# Altium schematic sheet Power.SchDoc
size B; DocumentNumber: 6; SheetNumber: 6; SheetTotal: 7; ENG_APP_DATE: --/--/--; DSN_APP_DATE: --/--/--; CHK_APP_DATE: --/--/--
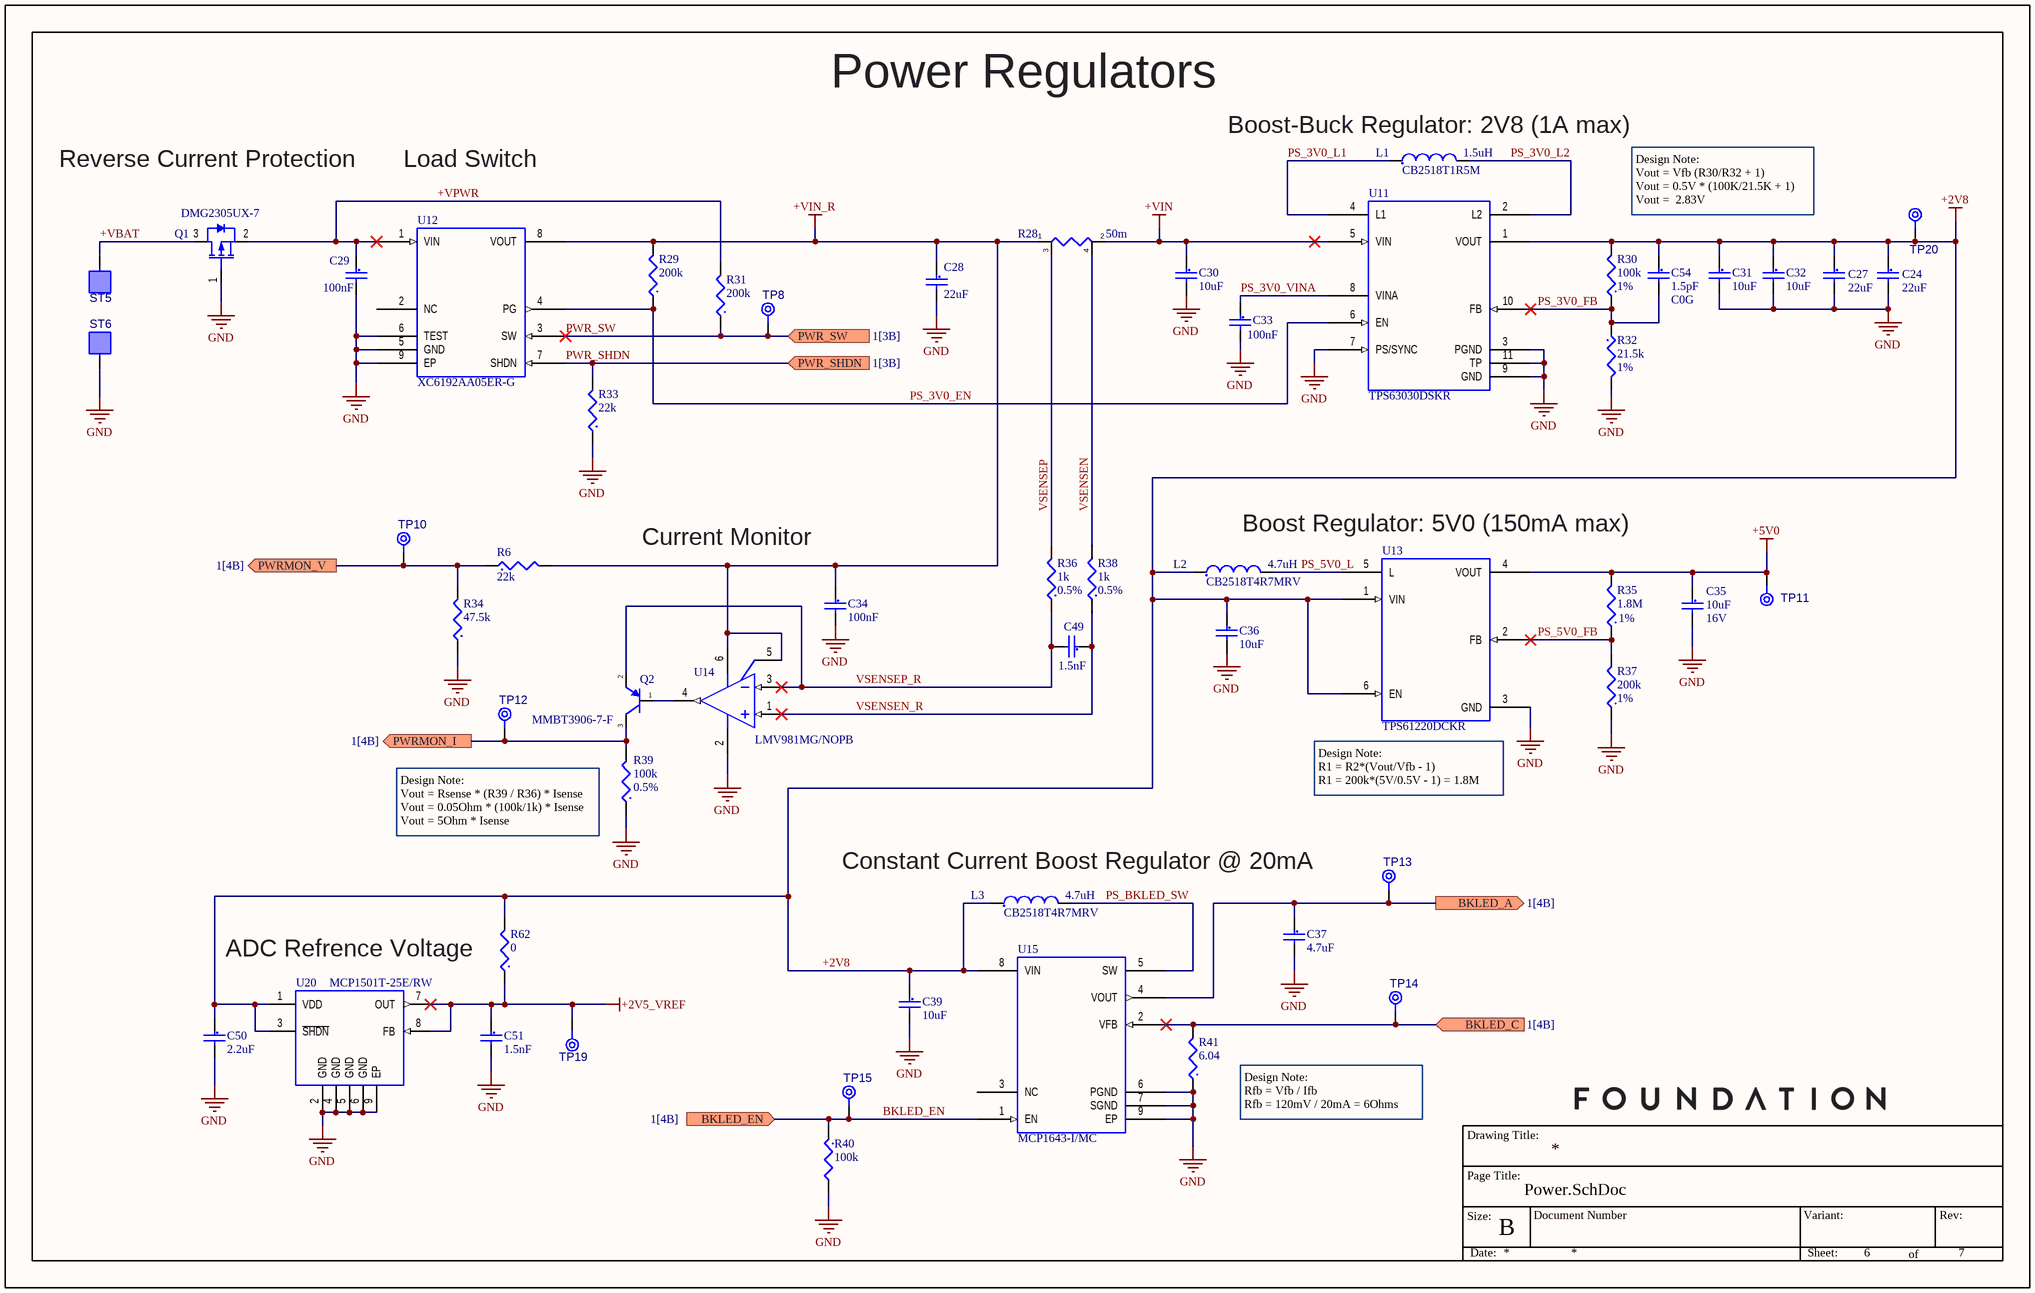
[diagram p0: Power.SchDoc]

## Parts
C24  Capacitance: 22uF  [CAPC0805(2012)145_L]  (hidden comment: CAP CER 22uF 16V 10% X5R 0805)
C27  Capacitance: 22uF  [CAPC0805(2012)145_L]  (hidden comment: CAP CER 22uF 16V 10% X5R 0805)
C28  Capacitance: 22uF  [CAPC0805(2012)145_L]  (hidden comment: CAP CER 22uF 16V 10% X5R 0805)
C29  Capacitance: 100nF  [CAPC0402(1005)55_L]  (hidden comment: CAP CER 0.1uF 16V 10% X7R 0402)
C30  Capacitance: 10uF  [CAPC0603(1608)90_L]  (hidden comment: CAP CER 10uF 6.3V 20% X5R 0603)
C31  Capacitance: 10uF  [CAPC0603(1608)90_L]  (hidden comment: CAP CER 10uF 6.3V 20% X5R 0603)
C32  Capacitance: 10uF  [CAPC0603(1608)90_L]  (hidden comment: CAP CER 10uF 6.3V 20% X5R 0603)
C33  Capacitance: 100nF  [CAPC0402(1005)55_L]  (hidden comment: CAP CER 0.1uF 16V 10% X7R 0402)
C34  Capacitance: 100nF  [CAPC0402(1005)55_L]  (hidden comment: CAP CER 0.1uF 16V 10% X7R 0402)
C35  Capacitance: 10uF  Voltage Rating (DC): 16V  [CAPC0603(1608)90_L]  (hidden comment: CAP CER 10uF 16V 20% X5R 0603)
C36  Capacitance: 10uF  [CAPC0603(1608)90_L]  (hidden comment: CAP CER 10uF 6.3V 20% X5R 0603)
C37  Capacitance: 4.7uF  [CAPC0603(1608)90_L]  (hidden comment: CAP CER 4.7uF 16V 10% X5R 0603)
C39  Capacitance: 10uF  [CAPC0603(1608)90_L]  (hidden comment: CAP CER 10uF 6.3V 20% X5R 0603)
C49  Capacitance: 1.5nF  [CAPC0402(1005)55_L]  (hidden comment: CAP CER 1500pF 50V 10% X7R 0402)
C50  Capacitance: 2.2uF  [CAPC0402(1005)55_L]  (hidden comment: CAP CER 2.2uF 6.3V 10% X5R 0402)
C51  Capacitance: 1.5nF  [CAPC0402(1005)55_L]  (hidden comment: CAP CER 1500pF 50V 10% X7R 0402)
C54  Capacitance: 1.5pF  Dielectric: C0G  [CAPC0402(1005)55_L]  (hidden comment: CAP CER 1.5pF 50V C0G 0402)
L1  CB2518T1R5M  Inductance: 1.5uH  [INDC1007(2518)_L]
L2  CB2518T4R7MRV  Inductance: 4.7uH  [INDC1007(2518)_L]
L3  CB2518T4R7MRV  Inductance: 4.7uH  [INDC1007(2518)_L]
Q1  DMG2305UX-7  [DIOD-SOT23-3_A_V]
Q2  MMBT3906-7-F  [DIOD-SOT23-3_A_V]
R6  Resistance: 22k  [RESC0402(1005)_L]  (hidden comment: RES 22K 1/16W 1% 0402)
R28  Resistance: 50m  [RESC4T1206(3216)_V]  (hidden comment: RES4T 0.05 OHM 0.5% 1/2W 1206)
R29  Resistance: 200k  [RESC0402(1005)_L]  (hidden comment: RES 200K 1/16W 1% 0402)
R30  Resistance: 100k  Tolerance: 1%  [RESC0402(1005)_L]  (hidden comment: RES 100K 1/16W 1% 0402)
R31  Resistance: 200k  [RESC0402(1005)_L]  (hidden comment: RES 200K 1/16W 1% 0402)
R32  Resistance: 21.5k  Tolerance: 1%  [RESC0402(1005)_L]  (hidden comment: RES 21.5K 1/16W 1% 0402)
R33  Resistance: 22k  [RESC0402(1005)_L]  (hidden comment: RES 22K 1/16W 1% 0402)
R34  Resistance: 47.5k  [RESC0402(1005)_L]  (hidden comment: RES 47.5K 1/16W 1% 0402)
R35  Resistance: 1.8M  Tolerance: 1%  [RESC0402(1005)_L]  (hidden comment: RES 1.8M 1/16W 1% 0402)
R36  Resistance: 1k  Tolerance: 0.5%  [RESC0402(1005)_L]  (hidden comment: RES 1.0K 1/16W 1% 0402)
R37  Resistance: 200k  Tolerance: 1%  [RESC0402(1005)_L]  (hidden comment: RES 200K 1/16W 1% 0402)
R38  Resistance: 1k  Tolerance: 0.5%  [RESC0402(1005)_L]  (hidden comment: RES 1.0K 1/16W 1% 0402)
R39  Resistance: 100k  Tolerance: 0.5%  [RESC0402(1005)_L]  (hidden comment: RES 100K 1/16W 0.5% 0402)
R40  Resistance: 100k  [RESC0402(1005)_L]  (hidden comment: RES 100K 1/16W 1% 0402)
R41  Resistance: 6.04  [RESC0402(1005)_L]  (hidden comment: RES 6.04 OHM 1/16W 1% 0402)
R62  Resistance: 0  [RESC0402(1005)_L]  (hidden comment: RES 0 OHM JUMPER 1/16W 0402)
ST5  PAD-2_54X2_54Y  [PAD-2_54X2_54Y]  (value not drawn)  (no BOM)
ST6  PAD-2_54X2_54Y  [PAD-2_54X2_54Y]  (value not drawn)  (no BOM)
TP8  TPAD8R  [TP08R]  (value not drawn)  (no BOM)
TP10  TPAD8R  [TP08R]  (value not drawn)  (no BOM)
TP11  TPAD8R  [TP08R]  (value not drawn)  (no BOM)
TP12  TPAD8R  [TP08R]  (value not drawn)  (no BOM)
TP13  TPAD8R  [TP08R]  (value not drawn)  (no BOM)
TP14  TPAD8R  [TP08R]  (value not drawn)  (no BOM)
TP15  TPAD8R  [TP08R]  (value not drawn)  (no BOM)
TP19  TPAD8R  [TP08R]  (value not drawn)  (no BOM)
TP20  TPAD8R  [TP08R]  (value not drawn)  (no BOM)
U11  TPS63030DSKR  [TI - VSON-10_L]
U12  XC6192AA05ER-G  [TORX - USP-8B06_V]
U13  TPS61220DCKR  [TI - SC70-6_L]
U14  LMV981MG/NOPB  [TI - SC70-6_L]
U15  MCP1643-I/MC  [MCHP - DFN-8_L]
U20  MCP1501T-25E/RW  [MCHP - WDFN-8_L]

## Ports
BKLED_A (out, see 1[4B]), BKLED_C (in, see 1[4B]), BKLED_EN (in, see 1[4B]), PWR_SHDN (in, see 1[3B]), PWR_SW (in, see 1[3B]), PWRMON_I (out, see 1[4B]), PWRMON_V (out, see 1[4B])

## Nets
+2V5_VREF: C51.1 R62.1 TP19.1(TP) U20.7(OUT) U20.8(FB)
+2V8: C24.1 C27.1 C31.1 C32.1 C36.1 C39.1 C50.1 C54.1 L2.1 L3.1 R30.2 R62.2 TP20.1(TP) U11.1(VOUT) U13.1(VIN) U13.6(EN) U15.8(VIN) U20.1(VDD) U20.3(~{SHDN})
+5V0: C35.1 R35.2 TP11.1(TP) U13.4(VOUT)
+VIN: C30.1 R28.2(I2) U11.5(VIN)
+VIN_R: C28.1 C34.1 R6.2 R28.1(I1) R29.2 U12.8(VOUT) U14.5(~{SHDN}) U14.6(VDD)
GND: C24.2 C27.2 C28.2 C29.2 C30.2 C31.2 C32.2 C33.2 C34.2 C35.2 C36.2 C37.2 C39.2 C50.2 C51.2 Q1.1(GATE) R32.2 R33.1 R34.1 R37.1 R39.1 R40.2 R41.1 ST6.1 U11.3(PGND) U11.7(PS/SYNC) U11.9(GND) U11.11(TP) U12.5(GND) U12.6(TEST) U12.9(EP) U13.3(GND) U14.2(GND) U15.6(PGND) U15.7(SGND) U15.9(EP) U20.2(GND) U20.4(GND) U20.5(GND) U20.6(GND) U20.9(EP)
+VBAT: Q1.3(DRAIN) ST5.1
+VPWR: C29.1 Q1.2(SOURCE) R31.2 U12.1(VIN)
BKLED_A: C37.1 TP13.1(TP) U15.4(VOUT) ; port BKLED_A
BKLED_C: R41.2 TP14.1(TP) U15.2(VFB) ; port BKLED_C
BKLED_EN: R40.1 TP15.1(TP) U15.1(EN) ; port BKLED_EN
PS_3V0_EN: R29.1 U11.6(EN) U12.4(PG)
PS_3V0_FB: C54.2 R30.1 R32.1 U11.10(FB)
PS_3V0_L1: L1.1 U11.4(L1)
PS_3V0_L2: L1.2 U11.2(L2)
PS_3V0_VINA: C33.1 U11.8(VINA)
PS_5V0_FB: R35.1 R37.2 U13.2(FB)
PS_5V0_L: L2.2 U13.5(L)
PS_BKLED_SW: L3.2 U15.5(SW)
PWR_SHDN: R33.2 U12.7(SHDN) ; port PWR_SHDN
PWR_SW: R31.1 TP8.1(TP) U12.3(SW) ; port PWR_SW
PWRMON_I: Q2.3(C) R39.2 TP12.1(TP) ; port PWRMON_I
PWRMON_V: R6.1 R34.2 TP10.1(TP) ; port PWRMON_V
VSENSEN: R28.4(E2) R38.2
VSENSEN_R: C49.1 R38.1 U14.1(IN+)
VSENSEP: R28.3(E1) R36.2
VSENSEP_R: C49.2 Q2.2(E) R36.1 U14.3(IN-)
NetQ2_1: Q2.1(B) U14.4(OUT)

Not connected (* = marked no-connect by the designer): U12 2(NC); U15 3(NC)

## Notes on the sheet
- Power Regulators
- (near L1) Boost-Buck Regulator: 2V8 (1A max)
- Reverse Current Protection
- Load Switch
- Design Note:
  Vout = Vfb (R30/R32 + 1)
  Vout = 0.5V * (100K/21.5K + 1)
  Vout =  2.83V
- (near C34) Current Monitor
- Boost Regulator: 5V0 (150mA max)
- Design Note:
  Vout = Rsense * (R39 / R36) * Isense
  Vout = 0.05Ohm * (100k/1k) * Isense
  Vout = 5Ohm * Isense
- (near U13) Design Note:
  R1 = R2*(Vout/Vfb - 1)
  R1 = 200k*(5V/0.5V - 1) = 1.8M
- (near L3) Constant Current Boost Regulator @ 20mA
- ADC Refrence Voltage
- Design Note:
  Rfb = Vfb / Ifb
  Rfb = 120mV / 20mA = 6Ohms
- Drawing Title:
- Page Title:
- Size:
- B
- Document Number
- Variant:
- Rev:
- Date:
- Sheet:
- of

## Library data of the parts
C24 C27 C28 = CMP-CAP-00010-2: 22µF ±10% 16V Ceramic Capacitor X5R 0805 (2012 Metric); Packaging: Tape and Reel; Length: 2mm; Max Operating Temperature: 85°C; REACH SVHC: No SVHC; Lead Free: Lead Free; Termination: SMD/SMT; Width: 0.049inch; Thickness: 0.057inch; Min Operating Temperature: -55°C; Height: 1.25mm; Tolerance: 10%; Case/Package: 0805; Dielectric: X5R; Voltage: 16V; Mount: Surface Mount; Case Code (Imperial): 0805; Dielectric Material: Ceramic; Voltage Rating: 16V; Voltage Rating (DC): 16V; Depth: 1.25mm; Case Code (Metric): 2012; Package Quantity: 1; Weight: 0.000194oz; Number of Pins: 2; Composition: Ceramic
C29 C33 C34 = CMP-CAP-00002-2: 0.1µF ±10% 16V Ceramic Capacitor X7R 0402 (1005 Metric); Insulation Resistance: 10GR; Material: Ceramic; Tolerance: 10%; REACH SVHC: No SVHC; Radiation Hardening: No; Case Code (Metric): 1005; Height: 0.5mm; Depth: 0.5mm; Min Operating Temperature: -55°C; Max Operating Temperature: 125°C; Lead Free: Lead Free; Thickness: 0.022inch; Length: 1mm; Voltage Rating (DC): 16V; Dielectric Material: Ceramic; Packaging: Tape and Reel; Case/Package: 0402; Width: 0.5mm; Termination: SMD/SMT; Voltage Rating: 16V; Mount: Surface Mount; Case Code (Imperial): 0402; Package Quantity: 1; Dielectric: X7R; Number of Pins: 2; Voltage: 16V
C30-C32 C36 C39 = CMP-CAP-00044-1: 10µF ±20% 6.3V Ceramic Capacitor X5R 0603 (1608 Metric); Max Operating Temperature: 85°C; Packaging: Tape and Reel; Case Code (Metric): 1608; Radiation Hardening: No; REACH SVHC: No SVHC; Min Operating Temperature: -55°C; Tolerance: 20%; Lead Free: Lead Free; Thickness: 0.035inch; Voltage Rating (DC): 6.3V; Material: Ceramic; Width: 0.031inch; Length: 1.6mm; Voltage: 6.3V; Mount: Surface Mount; Voltage Rating: 6.3V; Termination: SMD/SMT; Depth: 0.8mm; Dielectric: X5R; Case/Package: 0603; Package Quantity: 4000; Case Code (Imperial): 0603; Height: 0.8mm
C35 = CMP-CAP-00036-1: 10µF ±20% 16V Ceramic Capacitor X5R 0603 (1608 Metric); Termination: SMD/SMT; Mount: Surface Mount; Halogen Free: Halogen Free; Packaging: Tape and Reel; Width: 0.031inch; Length: 0.063inch; Voltage Rating: 16V; Thickness: 0.031inch; Package Quantity: 1; REACH SVHC: Unknown; Max Operating Temperature: 85°C; Min Operating Temperature: -55°C; Case Code (Imperial): 0603; Dielectric: X5R; Height: 0.8mm; Case/Package: 0603; Tolerance: 20%; Case Code (Metric): 1608
C37 = CMP-CAP-00003-1: 4.7µF ±10% 16V Ceramic Capacitor X5R 0603 (1608 Metric); Max Operating Temperature: 85°C; Packaging: Tape and Reel; Case Code (Metric): 1608; REACH SVHC: No SVHC; Min Operating Temperature: -55°C; Tolerance: 10%; Thickness: 0.035inch; Voltage Rating (DC): 16V; Width: 0.8mm; Length: 1.6mm; Mount: Surface Mount; Voltage Rating: 16V; Termination: SMD/SMT; Dielectric: X5R; Case/Package: 0603; Package Quantity: 1; Case Code (Imperial): 0603; Height: 0.8mm; Composition: Ceramic; Number of Pins: 2
C49 C51 = CMP-CAP-00034-1: 1500pF ±10% 50V Ceramic Capacitor X7R 0402 (1005 Metric); Material: Ceramic; Tolerance: 10%; Radiation Hardening: No; Case Code (Metric): 1005; Height: 0.5mm; Depth: 0.5mm; Min Operating Temperature: -55°C; Max Operating Temperature: 125°C; Thickness: 0.022inch; Length: 1mm; Packaging: Tape and Reel; Case/Package: 0402; Width: 0.02inch; Voltage Rating: 50V; Mount: Surface Mount; Case Code (Imperial): 0402; Package Quantity: 1; Dielectric: X7R; Voltage: 50V; Contact Plating: Tin
C50 = CMP-CAP-00042-1: 2.2µF ±10% 6.3V Ceramic Capacitor X5R 0402 (1005 Metric); Lead Free: Lead Free; Tolerance: 10%; Width: 0.02inch; Number of Pins: 2; Contact Plating: Tin,Matte; Max Operating Temperature: 85°C; Termination: SMD/SMT; Voltage Rating: 6.3V; Thickness: 0.022inch; Case Code (Imperial): 0402; Case Code (Metric): 1005; Radiation Hardening: No; Package Quantity: 1; Mount: Surface Mount; Length: 1mm; Case/Package: 0402; REACH SVHC: No SVHC; Packaging: Tape and Reel; Min Operating Temperature: -55°C; Dielectric: X5R; Depth: 0.5mm; Voltage Rating (DC): 6.3V
C54 = CMP-CAP-00048-1: 1.5pF ±0.25pF 50V Ceramic Capacitor C0G, NP0 0402 (1005 Metric); Tolerance: 20%; Mount: Surface Mount; Min Operating Temperature: -55°C; Lead Free: Lead Free; Termination: SMD/SMT; Width: 0.02inch; Voltage: 50V; Height: 0.5mm; Package Quantity: 1; Voltage Rating (DC): 50V; Packaging: Tape and Reel; Max Operating Temperature: 125°C; Case Code (Imperial): 0402; Voltage Rating: 50V; Case/Package: 0402; Case Code (Metric): 1005; Thickness: 0.022inch; Length: 1mm; Radiation Hardening: No; Depth: 0.5mm
L1 = CMP-IND-0004-1: 1.5µH Unshielded Wirewound Inductor 1.4A 91mOhm Max 1007 (2518 Metric); Test Frequency: 7.96MHz; Saturation Current: 650mA; Tolerance: 20%; Self Resonant Frequency: 80MHz; DC Resistance (DCR): 91mR; Core Material: Ferrite; Termination: SMD/SMT; Shielding: Unshielded; Min Operating Temperature: -40°C; Current Rating: 1.4A; Max Operating Temperature: 105°C; Width: 1.8mm; Case/Package: 1007; Mount: Surface Mount; Height: 1.8mm; Height - Seated (Max): 0.079inch; Packaging: Tape and Reel; Length: 0.098inch; Composition: Wirewound; Package Quantity: 2000; Max DC Current: 650mA; ComponentLink1Description: Datasheet; ComponentLink1URL: https://www.yuden.co.jp/productdata/catalog/wound02_e.pdf; Radiation Hardening: No; Depth: 2mm; Lead Free: Lead Free; Case Code (Imperial): 1007; Halogen Free: Halogen Free; Case Code (Metric): 2518
L2 L3 = CMP-IND-0006-1: 4.7µH Unshielded Wirewound Inductor 820mA 130mOhm Max 1007 (2518 Metric); Max DC Current: 310mA; Tolerance: 20%; Test Frequency: 7.96MHz; DC Resistance (DCR): 130mR; Self Resonant Frequency: 46MHz; Resistance: 0.1R; Shielding: Unshielded; Height: 1.8mm; Packaging: Tape and Reel; Depth: 1.8mm; Mount: Surface Mount; Composition: Wirewound; Min Operating Temperature: -40°C; Current Rating: 820mA; Width: 0.071inch; Length: 0.098inch; Case/Package: 1007; Height - Seated (Max): 0.079inch; Termination: SMD/SMT; Package Quantity: 2000; Saturation Current: 310mA; Lead Free: Lead Free; Max Operating Temperature: 105°C; Case Code (Metric): 2518; Radiation Hardening: No; Case Code (Imperial): 1007
Q1 = CMP-TRNST-0000-3: P-Channel 20V 4.2A (Ta) 1.4W (Ta) Surface Mount SOT-23; Turn-Off Delay Time: 79.3ns; Fall Time: 34.7ns; On-State Resistance: 52MR; Vgs(th) (Max) @ Id: 900mV @ 250µA; Gate to Source Voltage (Vgs): 8V; Number of Channels: 1; Input Capacitance: 808pF; Element Configuration: Single; Threshold Voltage: -900mV; Drain to Source Resistance: 200mR; Rise Time: 13.7ns; Turn-On Delay Time: 10.8ns; ComponentLink1Description: Datasheet; Mount: Surface Mount; Max Operating Temperature: 150°C; Packaging: Tape and Reel; Continuous Drain Current (ID): 4.2A; REACH SVHC: No SVHC; Drain to Source Voltage (Vdss): 20V; RoHS Compliant: Yes; Height: 1.1mm; ComponentLink1URL: https://www.diodes.com/assets/Datasheets/DMG2305UX.pdf; Contact Plating: Tin,Matte; Weight: 0.000282oz; Package Quantity: 3000; Lead Free: Lead Free; Vgs (Max): 8V; Transistor Type: P-Channel; Rds On Max: 52mR; Width: 1.4mm; Number of Pins: 3; Max Power Dissipation: 1.4W; Case/Package: SOT-23; Min Operating Temperature: -55°C; Length: 3mm; Radiation Hardening: No
Q2 = CMP-TRNST-0001-1: TRANS PNP 40V 0.2A SOT23-3; Max Frequency: 250MHz; Continuous Collector Current: -200mA; Voltage Rating (DC): -40V; Element Configuration: Single; Number of Elements: 1; hFE Min: 100; Collector Emitter Saturation Voltage: -400mV; Power Dissipation: 300mW; Emitter Base Voltage (VEBO): 6V; Max Collector Current: 200mA; Max Operating Temperature: 150°C; Mount: Surface Mount; Packaging: Tape and Reel; Current Rating: -200mA; Gain Bandwidth Product: 250MHz; Case/Package: SOT-23; Collector Emitter Voltage (VCEO): 40V; Contact Plating: Tin,Matte; Transition Frequency: 250MHz; Collector Emitter Breakdown Voltage: 40V; ComponentLink1Description: Datasheet; Lead Free: Lead Free; Radiation Hardening: No; Collector Base Voltage (VCBO): 40V; Number of Pins: 3; ComponentLink1URL: https://media.digikey.com/pdf/Data%20Sheets/Diodes%20PDFs/MMBT3906.pdf; Frequency: 250MHz; Max Power Dissipation: 300mW; Package Quantity: 3000; Height: 1mm; Width: 1.4mm; Min Operating Temperature: -55°C; REACH SVHC: No SVHC; Length: 3.05mm; Polarity: PNP; Max Breakdown Voltage: 40V; Weight: 0.000282oz
R6 = CMP-RES-00040-1: 22 kOhms ±1% 0.063W, 1/16W Chip Resistor 0402 (1005 Metric); Temperature Coefficient: 100ppm/°C; Voltage Rating (DC): 50V; Power Rating: 63mW; Case/Package: 0402; Package Quantity: 10; Lead Free: Lead Free; Composition: Thick Film; Height: 0.35mm; Length: 1mm; Radiation Hardening: No; Width: 0.5mm; Max Operating Temperature: 155°C; Depth: 0.5mm; REACH SVHC: Unknown; Min Operating Temperature: -55°C; Case Code (Metric): 1005; Working Voltage: 50V; Mount: Surface Mount; Contact Plating: Tin; Number of Terminations: 2; Weight: 2.3E-05oz; Packaging: Tape and Reel; Termination: SMD/SMT; Tolerance: 1%; Case Code (Imperial): 0402; Military Standard: Not; Voltage Rating: 50V; Max Power Dissipation: 63mW; Features: Automotive AEC-Q200
R28 = CMP-RES-00044-2: 50 mOhms ±0.5% 0.5W, 1/2W Chip Resistor 1206 (3216 Metric) Current Sense; Temperature Coefficient: 35ppm/°C; Tolerance: 1%; Voltage Rating: 160mV; Max Power Dissipation: 500mW; Features: Moisture Resistant; Number of Terminations: 4; Length: 0.126inch; Case Code (Imperial): 1206; Lead Free: Lead Free; Composition: Metal Element; Max Operating Temperature: 170°C; Height: 0.035inch; Case/Package: 1206; Min Operating Temperature: -65°C; Case Code (Metric): 3216; Width: 0.063inch; Packaging: Tape and Reel
R29 R31 R37 = CMP-RES-00007-3: 200 kOhms ±1% 0.063W, 1/16W Chip Resistor 0402 (1005 Metric) Moisture Resistant Thick Film; Working Voltage: 50V; Temperature Coefficient: 100ppm/°C; Max Power Dissipation: 63mW; Power Rating: 62.5mW; Min Operating Temperature: -55°C; Depth: 0.5mm; Height: 0.016inch; Length: 1mm; Number of Terminations: 2; Termination: SMD/SMT; Composition: Thick Film; Military Standard: Not; Case Code (Metric): 1005; Case Code (Imperial): 0402; REACH SVHC: No SVHC; Voltage Rating (DC): 50V; Features: Moisture Resistant; Packaging: Tape and Reel; Width: 0.02inch; Lead Free: Lead Free; Package Quantity: 1; Voltage Rating: 50V; Case/Package: 0402; Max Operating Temperature: 155°C
  R29 R31: Tolerance: 1%
R30 = CMP-RES-00003-3: 100 kOhms ±1% 0.063W, 1/16W Chip Resistor 0402 (1005 Metric) Automotive AEC-Q200 Thick Film; Temperature Coefficient: 100ppm/°C; Max Power Dissipation: 63mW; Voltage Rating: 50V; Width: 0.02inch; Number of Terminations: 2; Composition: Thick Film; Radiation Hardening: No; Case Code (Imperial): 0402; Depth: 0.5mm; Packaging: Tape and Reel; Length: 1mm; Min Operating Temperature: -55°C; Contact Plating: Tin; Features: Automotive AEC-Q200; Max Operating Temperature: 155°C; Power Rating: 63mW; Mount: Surface Mount; Case Code (Metric): 1005; Case/Package: 0402; Height: 0.35mm; Lead Free: Lead Free; Military Standard: Not; Termination: SMD/SMT; Package Quantity: 10000; Voltage Rating (DC): 50V; REACH SVHC: Unknown; Number of Pins: 2; Weight: 2.3E-05oz
R32 = CMP-RES-00073-1: 21.5 kOhms ±1% 0.063W, 1/16W Chip Resistor 0402 (1005 Metric); Reference Standard: AEC-Q200; Package Height: 0.35mm; Rated Power Dissipation (P): 63mW; Rated Temperature: 70°C; Package Width: 0.5mm; Voltage Rating: 50V; Temperature Coefficient: 100ppm/°C; Number of Terminals/Pins: 2; Package Length: 1mm; Mount: Surface Mount; Resistor Type: FIXED RESISTOR; Max Operating Temperature: 155°C; JESD-609 Code: e3; Package Shape: Rectangular; Terminal Finish: Nickel; Packaging: Tape and Reel; Size Code: 0402; Package Style: SMTMeter; Technology: METAL GLAZE/THICK FILM; Termination: Wraparound; Working Voltage: 50V; Construction: Chip; Min Operating Temperature: -55°C
R33 = CMP-RES-00040-1: 22 kOhms ±1% 0.063W, 1/16W Chip Resistor 0402 (1005 Metric); Max Power Dissipation: 63mW; Voltage Rating: 50V; Temperature Coefficient: 100ppm/°C; Military Standard: Not; Lead Free: Lead Free; Max Operating Temperature: 155°C; Termination: SMD/SMT; REACH SVHC: Unknown; Packaging: Tape and Reel; Composition: Thick Film; Weight: 2.3E-05oz; Mount: Surface Mount; Height: 0.35mm; Length: 1mm; Min Operating Temperature: -55°C; Radiation Hardening: No; Voltage Rating (DC): 50V; Number of Terminations: 2; Features: Automotive AEC-Q200; Package Quantity: 10; Depth: 0.5mm; Working Voltage: 50V; Case/Package: 0402; Case Code (Metric): 1005; Case Code (Imperial): 0402; Tolerance: 1%; Power Rating: 63mW; Width: 0.5mm; Contact Plating: Tin
R34 = CMP-RES-00048-1: 47.5 kOhms ±1% 0.063W, 1/16W Chip Resistor 0402 (1005 Metric); Temperature Coefficient: 100ppm/°C; Power Rating: 63mW; Voltage Rating (DC): 50V; Number of Pins: 2; REACH SVHC: Unknown; Weight: 2.3E-05oz; Height: 0.35mm; Number of Terminations: 2; Case Code (Imperial): 0402; Case/Package: 0402; Features: Automotive AEC-Q200; Max Operating Temperature: 155°C; Case Code (Metric): 1005; Packaging: Tape and Reel; Length: 1mm; Min Operating Temperature: -55°C; Voltage Rating: 50V; Max Power Dissipation: 63mW; Package Quantity: 10; Mount: Surface Mount; Contact Plating: Tin; Tolerance: 1%; Width: 0.02inch; Lead Free: Lead Free; Composition: Thick Film; Radiation Hardening: No; Military Standard: Not; Termination: SMD/SMT; Depth: 0.5mm
R35 = CMP-RES-00016-4: 1.8 MOhms ±1% 0.063W, 1/16W Chip Resistor 0402 (1005 Metric); Voltage Rating: 50V; Power Rating: 63mW; Temperature Coefficient: 100ppm/°C; Height: 0.35mm; Composition: Thick Film; Case/Package: 0402; Contact Plating: Tin; Number of Pins: 2; REACH SVHC: Unknown; Lead Free: Lead Free; Radiation Hardening: No; Length: 1mm; Min Operating Temperature: -55°C; Max Operating Temperature: 155°C; Military Standard: Not; Mount: Surface Mount; Termination: SMD/SMT; Weight: 2.3E-05oz; Packaging: Tape and Reel; Depth: 0.5mm; Package Quantity: 10000; Case Code (Metric): 1005; Width: 0.5mm; Case Code (Imperial): 0402; Voltage Rating (DC): 50V
R36 R38 = CMP-RES-00000-3: 1 kOhms ±0.5% 0.063W, 1/16W Chip Resistor 0402 (1005 Metric) Automotive AEC-Q200 Thin Film; Voltage Rating: 25V; Power Rating: 62.5mW; Temperature Coefficient: 25ppm/°C; Max Power Dissipation: 63mW; Min Operating Temperature: -55°C; Radiation Hardening: No; Mount: Surface Mount; Height: 0.016inch; Military Standard: Not; Lead Free: Lead Free; Depth: 0.5mm; Package Quantity: 10000; Max Operating Temperature: 155°C; Weight: 2.8E-05oz; Case Code (Imperial): 0402; Number of Terminations: 2; Case Code (Metric): 1005; Termination: SMD/SMT; Packaging: Tape and Reel; Case/Package: 0402; Voltage Rating (DC): 25V; REACH SVHC: No SVHC; Width: 0.5mm; Length: 1mm; Contact Plating: Tin; Composition: Metal Film,Thin Film
R39 = CMP-RES-00046-1: 100 kOhms ±0.5% 0.063W, 1/16W Chip Resistor 0402 (1005 Metric); Temperature Coefficient: 25ppm/°C; Voltage Rating (DC): 25V; Max Power Dissipation: 63mW; Width: 0.5mm; REACH SVHC: No SVHC; Military Standard: Not; Contact Plating: Tin; Radiation Hardening: No; Min Operating Temperature: -55°C; Depth: 0.5mm; Composition: Metal Film,Thin Film; Case Code (Imperial): 0402; Termination: SMD/SMT; Number of Terminations: 2; Lead Free: Lead Free; Case Code (Metric): 1005; Mount: Surface Mount; Package Quantity: 10000; Voltage Rating: 25V; Max Operating Temperature: 155°C; Case/Package: 0402; Packaging: Tape and Reel; Power Rating: 63mW; Height: 0.016inch; Length: 1mm
R40 = CMP-RES-00003-3: 100 kOhms ±1% 0.063W, 1/16W Chip Resistor 0402 (1005 Metric) Automotive AEC-Q200 Thick Film; Max Power Dissipation: 63mW; Voltage Rating: 50V; Temperature Coefficient: 100ppm/°C; Max Operating Temperature: 155°C; Weight: 2.3E-05oz; Packaging: Tape and Reel; REACH SVHC: Unknown; Length: 1mm; Features: Automotive AEC-Q200; Depth: 0.5mm; Composition: Thick Film; Case Code (Imperial): 0402; Number of Terminations: 2; Package Quantity: 10000; Min Operating Temperature: -55°C; Number of Pins: 2; Lead Free: Lead Free; Military Standard: Not; Case/Package: 0402; Contact Plating: Tin; Tolerance: 1%; Radiation Hardening: No; Termination: SMD/SMT; Voltage Rating (DC): 50V; Mount: Surface Mount; Power Rating: 63mW; Case Code (Metric): 1005; Width: 0.02inch; Height: 0.35mm
R41 = CMP-RES-00008-4: 6.04 Ohms ±1% 0.063W, 1/16W Chip Resistor 0402 (1005 Metric); Max Power Dissipation: 63mW; Temperature Coefficient: 100ppm/°C; Voltage Rating: 50V; Weight: 2.3E-05oz; Package Quantity: 10; Power Rating: 63mW; Length: 1mm; Height: 0.016inch; Min Operating Temperature: -55°C; Military Standard: Not; Termination: SMD/SMT; Case/Package: 0402; Contact Plating: Tin; Depth: 0.5mm; Number of Terminations: 2; Features: Automotive AEC-Q200; Case Code (Metric): 1005; Composition: Thick Film; Max Operating Temperature: 155°C; Lead Free: Lead Free; Width: 0.02inch; Packaging: Tape and Reel; Case Code (Imperial): 0402; Tolerance: 1%
R62 = CMP-RES-00014-4: 0 Ohms Jumper 0.063W, 1/16W Chip Resistor 0402 (1005 Metric); Temperature Coefficient: 200ppm/°C; Power Rating: 62.5mW; Max Power Dissipation: 63mW; Tolerance: 5%; Voltage Rating: 50V; Lead Free: Lead Free; Height: 0.016inch; Military Standard: Not; Max Operating Temperature: 155°C; Features: Moisture Resistant; Case/Package: 0402; Contact Plating: Tin,Matte; Composition: Thick Film; Number of Terminations: 2; Case Code (Imperial): 0402; Package Quantity: 1; REACH SVHC: Unknown; Radiation Hardening: No; Case Code (Metric): 1005; Width: 0.02inch; Termination: SMD/SMT; Min Operating Temperature: -55°C; Length: 1mm; Packaging: Tape and Reel; Depth: 0.5mm
ST5 ST6 = CMP-MECH-00004-4: Pad, 2.54mm x 2.54mm
TP8 TP10-TP15 TP19 TP20 = CMP-MECH-00011-2: 0.8mm round; Pins: 1
U11 = CMP-PMIC-00002-5: Buck-Boost Switching Regulator IC Positive Adjustable 1.2V 1 Output 900mA (Switch) 10-WFDFN Exposed Pad; Min Supply Voltage: 1.8V; Quiescent Current: 25uA; Synchronous Rectifier: Yes; Max Output Current: 800mA; Max Output Voltage: 5.5V; Nominal Supply Current: 50uA; Switching Frequency: 2.4MHz; Efficiency: 96%; Number of Outputs: 1; Topology: Buck-Boost; ComponentLink1Description: Datasheet; ComponentLink1URL: http://www.ti.com/lit/ds/symlink/tps63030.pdf; Radiation Hardening: No; Max Operating Temperature: 85°C; Min Operating Temperature: -40°C; Package Quantity: 3000; REACH SVHC: No SVHC; Number of Pins: 10; Packaging: Tape and Reel; Case/Package: 10-SON (2.5x2.5); Output Type: Adjustable; Lead Free: Lead Free; Output Configuration: Positive; Output Current: 800mA; Mount: Surface Mount; Operating Supply Voltage: 5.5V; Contact Plating: Gold; Min Input Voltage: 1.8V; Max Input Voltage: 5.5V; Output Voltage: 5.5V; Min Output Voltage: 1.2V
U12 = CMP-PMIC-00012-5: Power Switch/Driver 1:1 P-Channel 400mA USP-8B06; Fault Protection: Short Circuit; Interface: On/Off; Number of Outputs: 1; Output Configuration: High Side; ComponentLink1Description: Datasheet; Packaging: Tape and Reel; Max Output Current: 400mA; Max Operating Temperature: 85°C; ComponentLink1URL: https://www.torexsemi.com/file/xc6192/XC6192.pdf; Min Operating Temperature: -40°C
U13 = CMP-PMIC-00004-1: Boost Switching Regulator IC Positive Adjustable 1.8V 1 Output 200mA (Switch) 6-TSSOP, SC-88, SOT-363; Efficiency: 95%; Switching Frequency: 2MHz; Output Voltage: 5.5V; Max Output Current: 500mA; Synchronous Rectifier: Yes; Number of Outputs: 1; Quiescent Current: 5uA; Min Input Voltage: 700mV; REACH SVHC: No SVHC; Min Operating Temperature: -40°C; Max Operating Temperature: 85°C; Packaging: Tape and Reel; ComponentLink1Description: Datasheet; Package Quantity: 1; Output Type: Adjustable; Min Output Voltage: 1.8V; Max Output Voltage: 5.5V; Operating Supply Voltage: 5.5V; Number of Pins: 6; Topology: Boost; ComponentLink1URL: http://www.ti.com/lit/ds/symlink/tps61220.pdf; Lead Free: Lead Free; Radiation Hardening: No; Output Current: 200mA; Max Input Voltage: 5.5V
U14 = CMP-IC-AMP-0000-7: General Purpose Amplifier 1 Circuit Rail-to-Rail SC-70-6; Slew Rate: 0.42V/µs; Output Current: 8mA; Output Current per Channel: 100mA; Number of Amplifiers: 1; Common Mode Rejection Ratio: 50dB; Operating Supply Current: 116uA; Unity Gain Bandwidth Product: 1.5MHz; Nominal Supply Current: 103uA; Bandwidth: 1.4MHz; Power Supply Rejection Ratio (PSRR): 75dB; Min Supply Voltage: 1.8V; Input Offset Voltage (Vos): 4mV; Max Supply Voltage: 5V; Operating Supply Voltage: 3V; Input Bias Current: 35nA; Voltage Gain: 113dB; ComponentLink1Description: Datasheet; Length: 2mm; Radiation Hardening: No; Width: 1.25mm; Min Operating Temperature: -40°C; Number of Circuits: 1; REACH SVHC: No SVHC; Contact Plating: Tin; Case/Package: SC; Number of Channels: 1; Package Quantity: 1000; Gain Bandwidth Product: 1.5MHz; Mount: Surface Mount; Height: 0.9mm; Weight: 0.01lb; Lead Free: Lead Free; ComponentLink1URL: http://www.ti.com/lit/ds/symlink/lmv981-n.pdf?ts=1588113028077; Number of Elements: 1; Packaging: Tape and Reel; Number of Pins: 6; Max Operating Temperature: 125°C
U15 = CMP-PMIC-00001-5: LED Driver IC 1 Output DC DC Regulator Step-Up (Boost) PWM Dimming 550mA 8-DFN (2x3); Output Voltage: 5V; Number of Outputs: 1; Nominal Input Voltage (DC): 500mV; Output Type: Adjustable; Output Current: 1.6A; Min Output Voltage: 600mV; Frequency: 1MHz; Weight: 0.001319oz; Package Quantity: 150; Case/Package: DFN; Max Operating Temperature: 85°C; Max Output Current: 550mA; Topology: Boost; Max Input Voltage: 5V; Number of Pins: 8; Min Operating Temperature: -40°C; Number of Channels: 1; Max Output Voltage: 5V; Max Supply Voltage: 5V; Switching Frequency: 1MHz; Mount: Surface Mount; Radiation Hardening: No; Output Current per Channel: 550mA; Min Input Voltage: 500mV; Dimming: PWM; Packaging: Rail/Tube; ComponentLink1Description: Datasheet; ComponentLink1URL: http://ww1.microchip.com/downloads/en/DeviceDoc/20005208A.pdf
U20 = CMP-PMIC-00034-1: Series Voltage Reference IC 2.5V ±0.1%  8-WDFN (2x2); Supply Voltage-Max (Vsup): 5.5V; Trim/Adjustable Output: No; Min Output Voltage: 2.4975V; Package Body Material: Plastic; Time @ Peak Reflow Temperature-Max (s): 30s; Temp Coef of Voltage-Max: 50ppm/°C; Max Output Voltage: 2.5025V; Supply Voltage-Min (Vsup): 2.7V; Number of Terminals/Pins: 8; Number of Functions: 1; Analog IC - Other Type: THREE TERMINAL VOLTAGE REFERENCE; ComponentLink1URL: https://ww1.microchip.com/downloads/en/DeviceDoc/20005474E.pdf; Min Operating Temperature: -40°C; ComponentLink1Description: Datasheet; Max Operating Temperature: 125°C; Package Code: HVSON; Terminal Finish: Tin; Height - Seated (Max): 0.8mm; Surface Mount: Yes; Width: 2mm; Package Style: SMALL OUTLINE, HEAT SINK/SLUG, VERY THIN PROFILEMeter; Nominal Output Voltage: 2.5V; JESD-30 Code: S-PDSO-N8; JESD-609 Code: e3; Length: 2mm; Terminal Position: DUAL; Terminal Pitch: 0.5mm; Peak Reflow Temperature (Cel): 260°C; Package Shape: Square; Temperature Grade: AUTOMOTIVE; Terminal Form: No Lead; Number of Outputs: 1